# EAGLE design M503A (EAGLE 6.6.0)
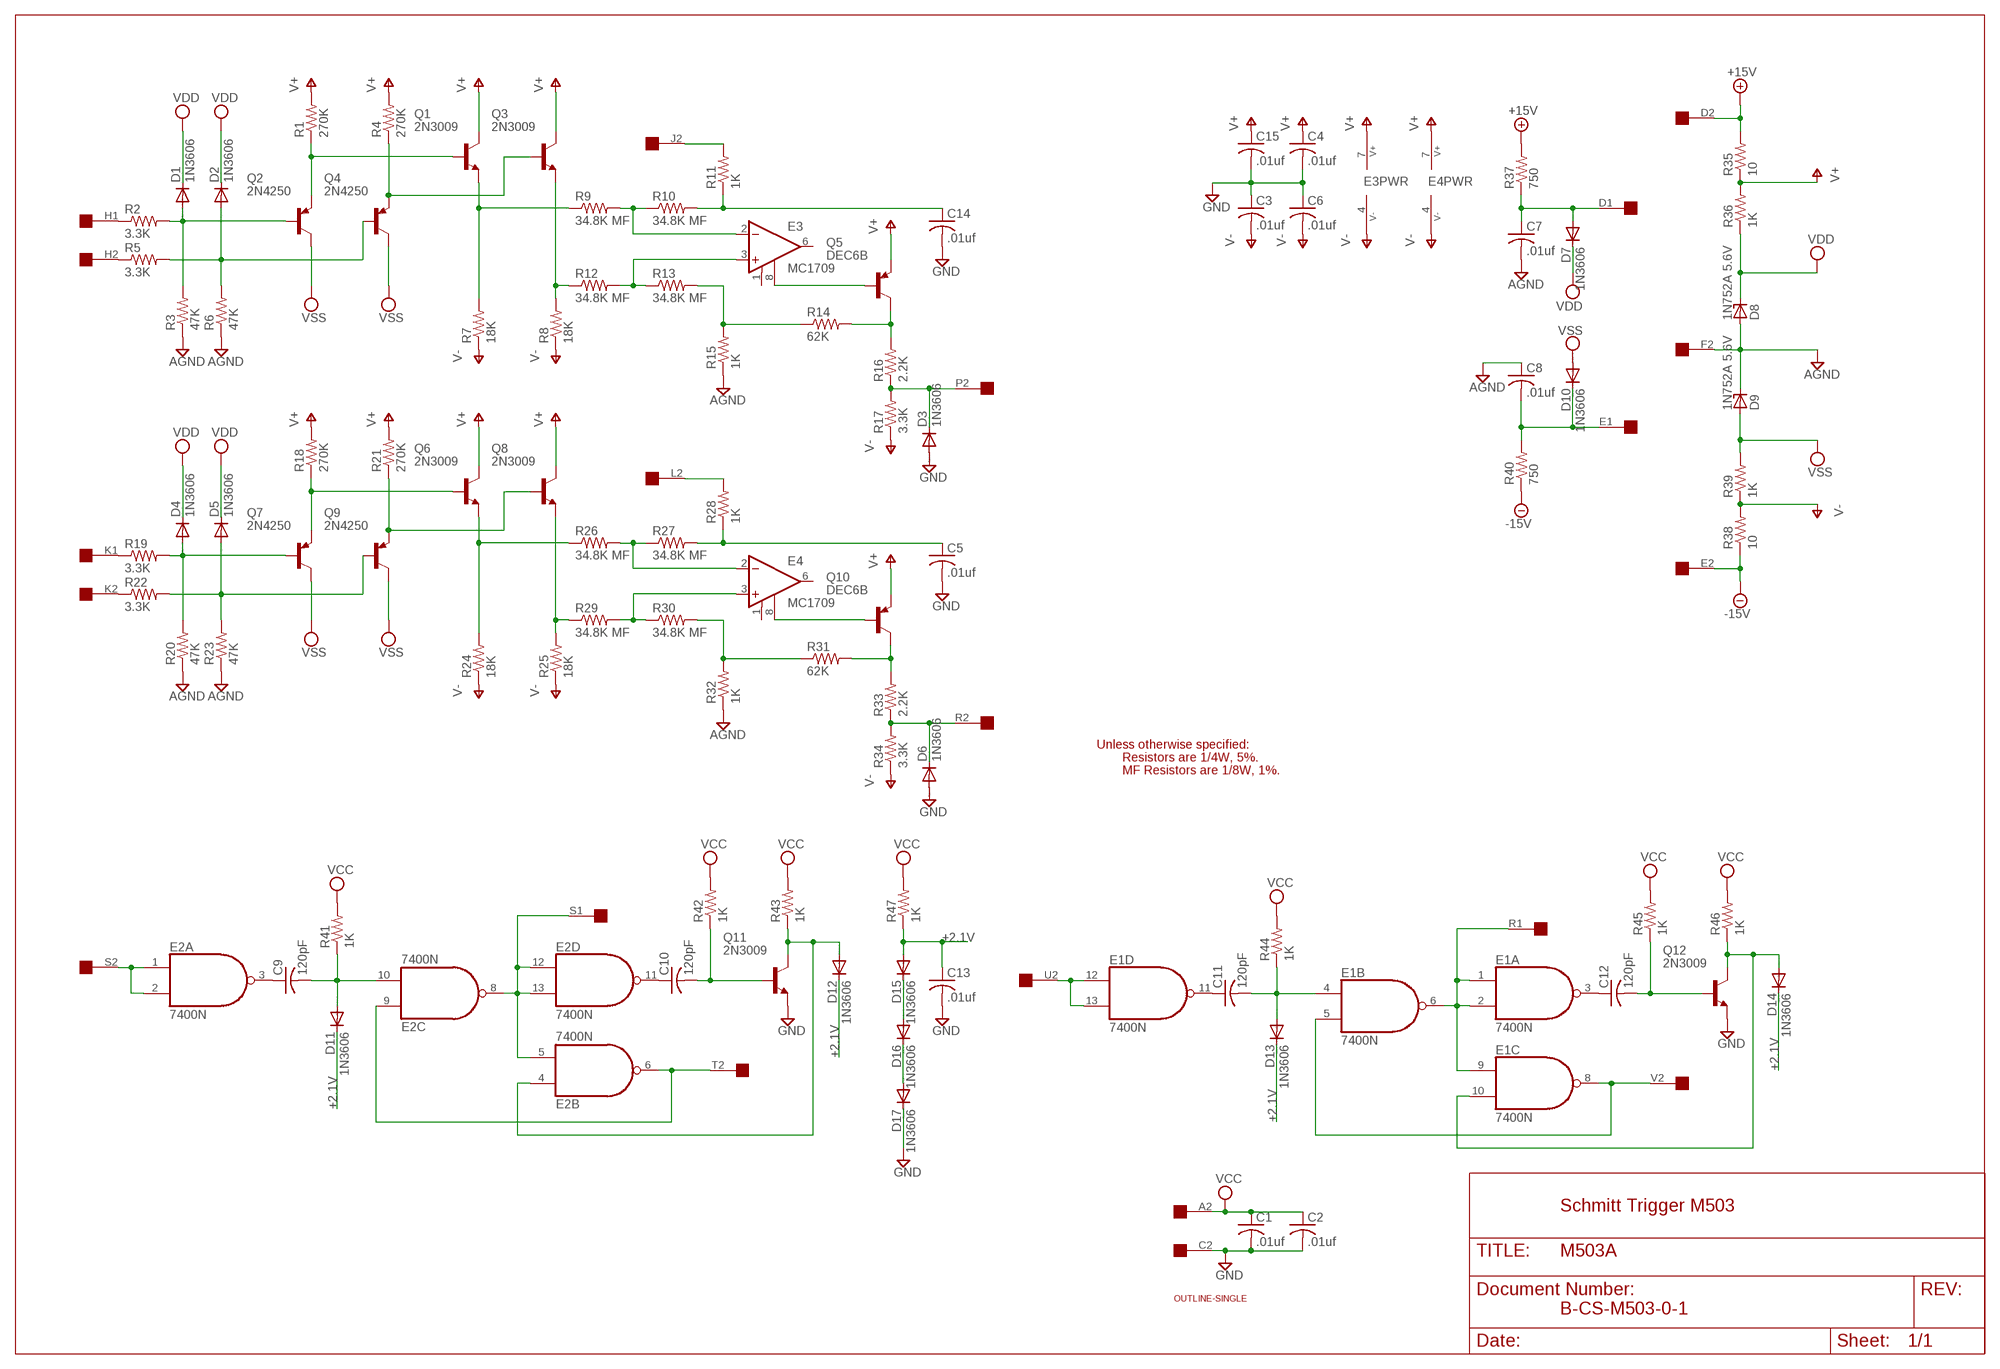
[diagram p0: schematic, sheet 1]

## Parts
C1  .01uf  C-US075-032X103  [C075-032X103]
C2  .01uf  C-US075-032X103  [C075-032X103]
C3  .01uf  C-US050-025X075  [C050-025X075]
C4  .01uf  C-US050-025X075  [C050-025X075]
C5  .01uf  C-US050-025X075  [C050-025X075]
C6  .01uf  C-US050-025X075  [C050-025X075]
C7  .01uf  C-US050-025X075  [C050-025X075]
C8  .01uf  C-US050-025X075  [C050-025X075]
C9  120pF  C-US050-025X075  [C050-025X075]
C10  120pF  C-US050-025X075  [C050-025X075]
C11  120pF  C-US050-025X075  [C050-025X075]
C12  120pF  C-US050-025X075  [C050-025X075]
C13  .01uf  C-US050-025X075  [C050-025X075]
C14  .01uf  C-US050-025X075  [C050-025X075]
C15  .01uf  C-US050-025X075  [C050-025X075]
D1  1N3606  1N4148DO35-10  [DO35-10]
D2  1N3606  1N4148DO35-10  [DO35-10]
D3  1N3606  1N4148DO35-10  [DO35-10]
D4  1N3606  1N4148DO35-10  [DO35-10]
D5  1N3606  1N4148DO35-10  [DO35-10]
D6  1N3606  1N4148DO35-10  [DO35-10]
D7  1N3606  1N4148DO35-10  [DO35-10]
D8  1N752A 5.6V  ZENER-DIODEDO35Z10  [DO35Z10]
D9  1N752A 5.6V  ZENER-DIODEDO35Z10  [DO35Z10]
D10  1N3606  1N4148DO35-10  [DO35-10]
D11  1N3606  1N4148DO35-10  [DO35-10]
D12  1N3606  1N4148DO35-10  [DO35-10]
D13  1N3606  1N4148DO35-10  [DO35-10]
D14  1N3606  1N4148DO35-10  [DO35-10]
D15  1N3606  1N4148DO35-10  [DO35-10]
D16  1N3606  1N4148DO35-10  [DO35-10]
D17  1N3606  1N4148DO35-10  [DO35-10]
E1  7400N  [DIL14]
E2  7400N  [DIL14]
E3  MC1709  LM301C  [TO99C]
E4  MC1709  LM301B  [TO99B]
Q1  2N3009  2N3019  [TO39]
Q2  2N4250  2N2904  [TO39]
Q3  2N3009  2N3019  [TO39]
Q4  2N4250  2N2904  [TO39]
Q5  DEC6B  2N2904  [TO39]
Q6  2N3009  2N3019  [TO39]
Q7  2N4250  2N2904  [TO39]
Q8  2N3009  2N3019  [TO39]
Q9  2N4250  2N2904  [TO39]
Q10  DEC6B  2N2904  [TO39]
Q11  2N3009  2N3019  [TO39]
Q12  2N3009  2N3019  [TO39]
R1  270K  R-US_0207/10  [0207/10]
R2  3.3K  R-US_0207/10  [0207/10]
R3  47K  R-US_0207/10  [0207/10]
R4  270K  R-US_0207/10  [0207/10]
R5  3.3K  R-US_0207/10  [0207/10]
R6  47K  R-US_0207/10  [0207/10]
R7  18K  R-US_0207/10  [0207/10]
R8  18K  R-US_0207/10  [0207/10]
R9  34.8K MF  R-US_0207/10  [0207/10]
R10  34.8K MF  R-US_0207/10  [0207/10]
R11  1K  R-US_0207/10  [0207/10]
R12  34.8K MF  R-US_0207/10  [0207/10]
R13  34.8K MF  R-US_0207/10  [0207/10]
R14  62K  R-US_0207/10  [0207/10]
R15  1K  R-US_0207/10  [0207/10]
R16  2.2K  R-US_0207/10  [0207/10]
R17  3.3K  R-US_0207/10  [0207/10]
R18  270K  R-US_0207/10  [0207/10]
R19  3.3K  R-US_0207/10  [0207/10]
R20  47K  R-US_0207/10  [0207/10]
R21  270K  R-US_0207/10  [0207/10]
R22  3.3K  R-US_0207/10  [0207/10]
R23  47K  R-US_0207/10  [0207/10]
R24  18K  R-US_0207/10  [0207/10]
R25  18K  R-US_0207/10  [0207/10]
R26  34.8K MF  R-US_0207/10  [0207/10]
R27  34.8K MF  R-US_0207/10  [0207/10]
R28  1K  R-US_0207/10  [0207/10]
R29  34.8K MF  R-US_0207/10  [0207/10]
R30  34.8K MF  R-US_0207/10  [0207/10]
R31  62K  R-US_0207/10  [0207/10]
R32  1K  R-US_0207/10  [0207/10]
R33  2.2K  R-US_0207/10  [0207/10]
R34  3.3K  R-US_0207/10  [0207/10]
R35  10  R-US_0207/10  [0207/10]
R36  1K  R-US_0207/10  [0207/10]
R37  750  R-US_0207/10  [0207/10]
R38  10  R-US_0207/10  [0207/10]
R39  1K  R-US_0207/10  [0207/10]
R40  750  R-US_0207/10  [0207/10]
R41  1K  R-US_0207/10  [0207/10]
R42  1K  R-US_0207/10  [0207/10]
R43  1K  R-US_0207/10  [0207/10]
R44  1K  R-US_0207/10  [0207/10]
R45  1K  R-US_0207/10  [0207/10]
R46  1K  R-US_0207/10  [0207/10]
R47  1K  R-US_0207/10  [0207/10]
U$2  SINGLE  [EDGE-CON2]
U$4  OUTLINE-SINGLE  [SINGLE]

## Nets
+2.1V: C13.1 D11.C D12.C D13.C D14.C D15.A R47.1
+15V [Supply]: R35.2 R37.2 U$2.D2
-15V [Supply]: R38.1 R40.1 U$2.E2
AGND [Supply]: C7.2 C8.1 D8.A D9.C R3.1 R6.1 R15.1 R20.1 R23.1 R32.1 U$2.F2
GND [Supply]: C1.2 C2.2 C3.1 C4.2 C5.2 C6.1 C13.2 C14.2 C15.2 D3.A D6.A D17.C Q11.1(E) Q12.1(E) U$2.C2
N$1: E1.1(A:I0) E1.2(A:I1) E1.6(B:O) E1.9(C:I0) U$2.R1
N$2: E1.5(B:I1) E1.8(C:O) U$2.V2
N$3: E1.12(D:I0) E1.13(D:I1) U$2.U2
N$4: C11.1 E1.11(D:O)
N$5: C11.2 D13.A E1.4(B:I0) R44.1
N$6: D14.A E1.10(C:I1) Q12.3(C) R46.1
N$7: Q6.2(B) Q7.1(E) R18.1
N$8: C12.2 Q12.2(B) R45.1
N$9: C12.1 E1.3(A:O)
N$10: E2.5(B:I1) E2.8(C:O) E2.12(D:I0) E2.13(D:I1) U$2.S1
N$11: E2.6(B:O) E2.9(C:I0) U$2.T2
N$12: C9.1 E2.3(A:O)
N$14: C9.2 D11.A E2.10(C:I1) R41.1
N$15: E2.1(A:I0) E2.2(A:I1) U$2.S2
N$16: Q1.2(B) Q2.1(E) R1.1
N$17: C10.2 Q11.2(B) R42.1
N$18: C10.1 E2.11(D:O)
N$19: D12.A E2.4(B:I0) Q11.3(C) R43.1
N$20: D1.A Q2.2(B) R2.2 R3.2
N$21: R2.1 U$2.H1
N$22: Q1.1(E) R7.2 R9.1
N$23: R5.1 U$2.H2
N$24: D2.A Q4.2(B) R5.2 R6.2
N$25: Q3.2(B) Q4.1(E) R4.1
N$26: Q3.1(E) R8.2 R12.1
N$27: E3.3(+IN) R12.2 R13.1
N$28: E3.2(-IN) R9.2 R10.1
N$29: C14.1 R10.2 R11.1
N$30: R13.2 R14.1 R15.2
N$31: E3.8(CMP) Q5.2(B)
N$32: Q5.3(C) R14.2 R16.2
N$33: R11.2 U$2.J2
N$34: D3.C R16.1 R17.2 U$2.P2
N$35: D4.A Q7.2(B) R19.2 R20.2
N$36: R22.1 U$2.K2
N$37: Q6.1(E) R24.2 R26.1
N$38: R19.1 U$2.K1
N$39: D5.A Q9.2(B) R22.2 R23.2
N$40: Q8.2(B) Q9.1(E) R21.1
N$41: Q8.1(E) R25.2 R29.1
N$42: E4.3(+IN) R29.2 R30.1
N$43: E4.2(-IN) R26.2 R27.1
N$44: C5.1 R27.2 R28.1
N$45: R30.2 R31.1 R32.2
N$46: E4.8(CMP) Q10.2(B)
N$47: Q10.3(C) R31.2 R33.2
N$48: R28.2 U$2.L2
N$49: D6.C R33.1 R34.2 U$2.R2
N$50: C7.1 D7.A R37.1 U$2.D1
N$51: C8.2 D10.C R40.2 U$2.E1
N$53: D15.C D16.A
N$54: D16.C D17.A
V+ [Supply]: C4.1 C15.1 E3.7(+10V) E4.7(+10V) Q1.3(C) Q3.3(C) Q5.1(E) Q6.3(C) Q8.3(C) Q10.1(E) R1.2 R4.2 R18.2 R21.2 R35.1 R36.2
V- [Supply]: C3.2 C6.2 E3.4(-15V) E4.4(-15V) R7.1 R8.1 R17.1 R24.1 R25.1 R34.1 R38.2 R39.1
VCC [Supply]: C1.1 C2.1 R41.2 R42.2 R43.2 R44.2 R45.2 R46.2 R47.2 U$2.A2
VDD [Supply]: D1.C D2.C D4.C D5.C D7.C D8.C R36.1
VSS [Supply]: D9.A D10.A Q2.3(C) Q4.3(C) Q7.3(C) Q9.3(C) R39.2
Unconnected: E3.1(ON/CMP) E3.6(OUT) E4.1(ON/CMP) E4.6(OUT) U$2.A1 U$2.B1 U$2.B2 U$2.C1 U$2.F1 U$2.J1 U$2.L1 U$2.M1 U$2.M2 U$2.N1 U$2.N2 U$2.P1 U$2.T1 U$2.U1 U$2.V1

## Notes on the sheet
- Unless otherwise specified:
- Resistors are 1/4W, 5%.
- MF Resistors are 1/8W, 1%.
- Schmitt Trigger M503
- B-CS-M503-0-1

## Power pins joined to a net without a drawn wire
GND: E1.7(P:GND) E2.7(P:GND)
VCC: E1.14(P:VCC) E2.14(P:VCC)

## Library data of the parts
C1-C15 = rcl:C-US: CAPACITOR, American symbol
D1-D7 D10-D17 = diode:1N4148: DIODE high speed (Philips)
D8 D9 = diode:ZENER-DIODE: Z-Diode
E1 E2 = 74xx-us:74*00: Quad 2-input NAND gate
E3 E4 = dec-con:LM301: LM301 Operational Amplifier
Q1 Q3 Q6 Q8 Q11 Q12 = transistor-npn:2N3019: NPN Transistor
Q2 Q4 Q5 Q7 Q9 Q10 = transistor-pnp:2N2904*: PNP Transistror
R1-R47 = rcl:R-US_: RESISTOR, American symbol
U$2 = dec-con:SINGLE: Single-Height DEC board
U$4 = dec-con:OUTLINE-*: Board outlines for DEC boards.

## Net classes
1 Supply: width 0.813 mm

## Board
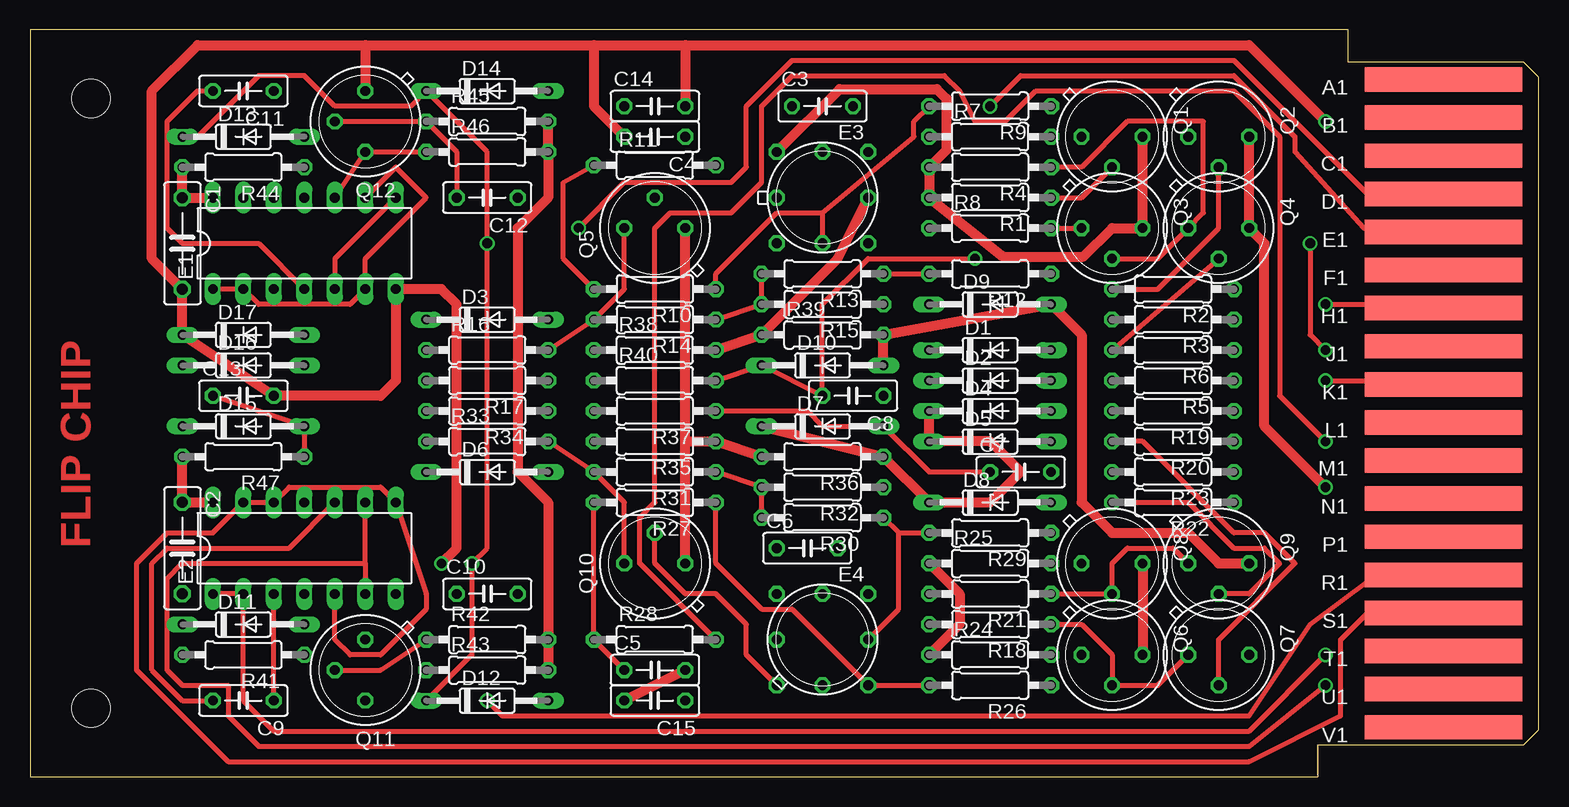
[diagram p1: board, top side]
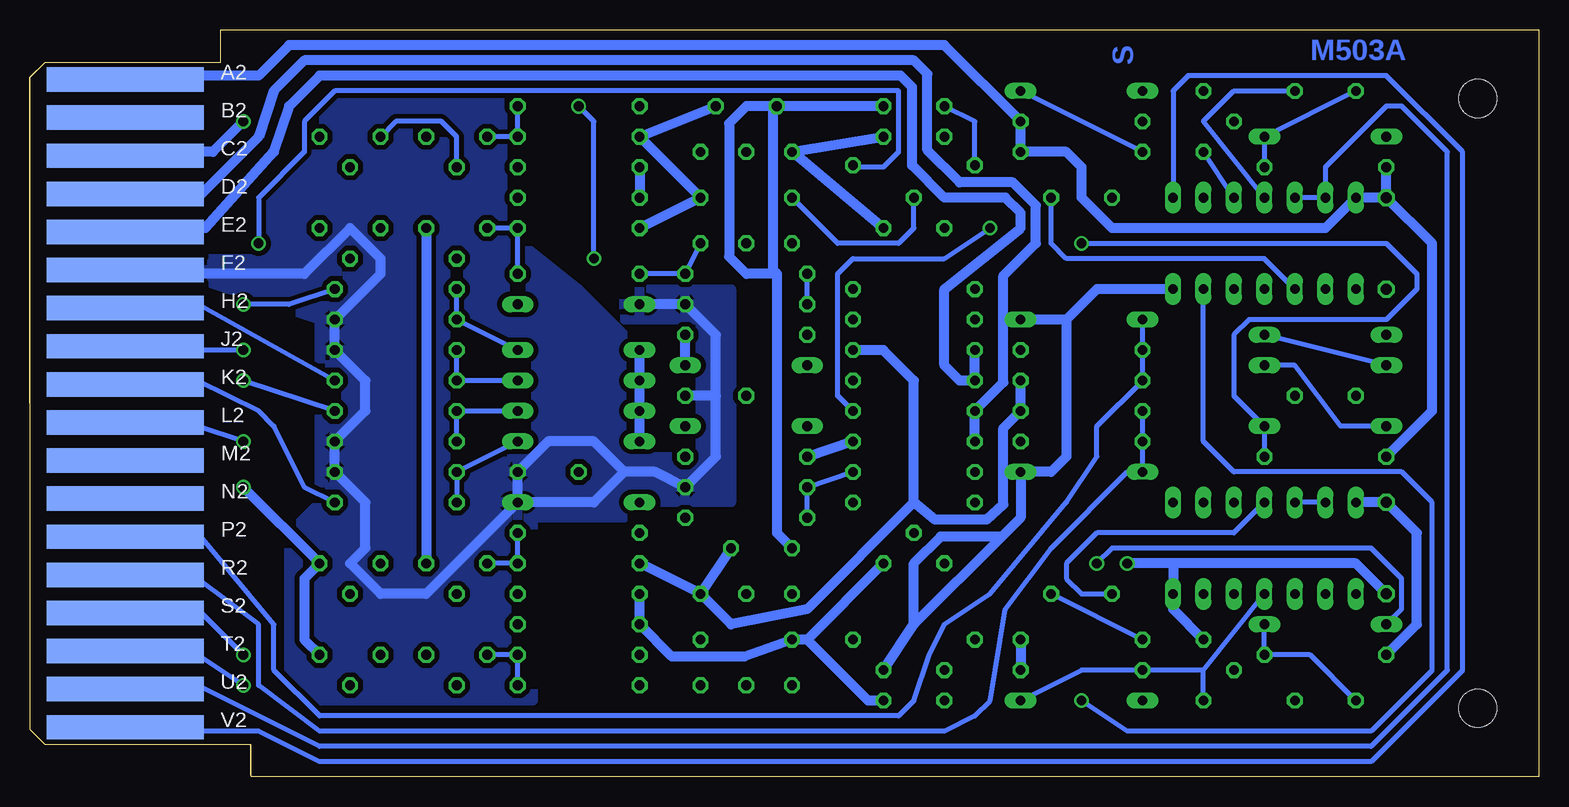
[diagram p2: board, bottom side, seen from below]

Size 125.73 x 62.23 mm. Coordinates in mm from the lower left corner, seen from the top.
Copper layers (1+16): Top 0.035mm / dielectric 1.5mm / Bottom 0.035mm
Design rules "16mils": minimum track width 16mil, minimum drill 32mil, track to track 15mil, track to pad 10mil, pad to pad 10mil, via to via 10mil, smd to smd 10mil, copper to edge 13mil, drill to drill 10mil, minimum pad ring 10mil, minimum via ring 8mil, stop-mask expansion 0mil, vias tented up to drill 0mil, thermal gap 10mil

### Footprints (pad centres in the part's own frame; a part is rotated, then mirrored left to right if it is on the bottom)
C075-032X103 = drill 0.914 octagon: 1 -3.81,0; 2 3.81,0
C050-025X075 = drill 0.813 octagon: 1 -2.54,0; 2 2.54,0
DO35-10 = drill 0.813 long: A 5.08,0; C -5.08,0
DO35Z10 = drill 0.813 long: A 5.08,0; C -5.08,0
DIL14 = drill 0.813 long: 1 -7.62,-3.81; 2 -5.08,-3.81; 3 -2.54,-3.81; 4 0,-3.81; 5 2.54,-3.81; 6 5.08,-3.81; 7 7.62,-3.81; 8 7.62,3.81; 9 5.08,3.81; 10 2.54,3.81; 11 0,3.81; 12 -2.54,3.81; 13 -5.08,3.81; 14 -7.62,3.81
TO99C = drill 0.813 octagon: 1 -3.81,-3.81; 2 0,-3.81; 3 3.81,-3.81; 4 3.81,0; 5 3.81,3.81; 6 0,3.81; 7 -3.81,3.81; 8 -3.81,0
TO99B = drill 0.813 octagon: 1 0,-3.81; 2 3.81,-3.81; 3 3.81,0; 4 3.81,3.81; 5 0,3.81; 6 -3.81,3.81; 7 -3.81,0; 8 -3.81,-3.81
TO39 = drill 0.813 octagon: 1 0,-2.54; 2 2.54,0; 3 0,2.54
0207/10 = drill 0.813 octagon: 1 -5.08,0; 2 5.08,0
EDGE-CON2 = smd 13.106 x 2.032: A1 7.938,4.128; B1 7.938,7.303; C1 7.938,10.477; D1 7.938,13.652; E1 7.938,16.828; F1 7.938,20.003; H1 7.938,23.177; J1 7.938,26.352; K1 7.938,29.527; L1 7.938,32.703; M1 7.938,35.877; N1 7.938,39.053; P1 7.938,42.227; R1 7.938,45.403; S1 7.938,48.578; T1 7.938,51.752; U1 7.938,54.928; V1 7.938,58.102 | smd 13.106 x 2.032 bottom: A2 7.938,4.128; B2 7.938,7.303; C2 7.938,10.477; D2 7.938,13.652; E2 7.938,16.828; F2 7.938,20.003; H2 7.938,23.177; J2 7.938,26.352; K2 7.938,29.527; L2 7.938,32.703; M2 7.938,35.877; N2 7.938,39.053; P2 7.938,42.227; R2 7.938,45.403; S2 7.938,48.578; T2 7.938,51.752; U2 7.938,54.928; V2 7.938,58.102
SINGLE = hole 3.175: 120.65,56.515; 120.65,5.715

### Placement (x,y rotation side)
C1  12.7,44.45 270 top
C2  12.7,19.05 270 top
C3  66.04,55.88 0 top
C4  52.07,53.34 180 top
C5  52.07,8.89 0 top
C6  64.77,19.05 0 top
C7  82.55,25.4 0 top
C8  68.58,31.75 180 top
C9  17.78,6.35 180 top
C10  38.1,15.24 0 top
C11  17.78,57.15 180 top
C12  38.1,48.26 180 top
C13  17.78,31.75 0 top
C14  52.07,55.88 0 top
C15  52.07,6.35 180 top
D1  80.01,35.56 0 top
D2  80.01,33.02 0 top
D3  38.1,38.1 0 top
D4  80.01,30.48 0 top
D5  80.01,27.94 0 top
D6  38.1,25.4 0 top
D7  66.04,29.21 0 top
D8  80.01,22.86 0 top
D9  80.01,39.37 0 top
D10  66.04,34.29 0 top
D11  17.78,12.7 0 top
D12  38.1,6.35 0 top
D13  17.78,53.34 0 top
D14  38.1,57.15 0 top
D15  17.78,29.21 0 top
D16  17.78,34.29 0 top
D17  17.78,36.83 0 top
E1  22.86,44.45 0 top
E2  22.86,19.05 0 top
E3  66.04,48.26 0 top
E4  66.04,11.43 0 top
Q1  90.17,53.34 270 top
Q2  99.06,53.34 270 top
Q3  90.17,45.72 270 top
Q4  99.06,45.72 270 top
Q5  52.07,45.72 90 top
Q6  90.17,10.16 270 top
Q7  99.06,10.16 270 top
Q8  90.17,17.78 270 top
Q9  99.06,17.78 270 top
Q10  52.07,17.78 90 top
Q11  27.94,8.89 180 top
Q12  27.94,54.61 180 top
R1  80.01,48.26 180 top
R2  95.25,40.64 180 top
R3  95.25,38.1 180 top
R4  80.01,50.8 180 top
R5  95.25,33.02 180 top
R6  95.25,35.56 180 top
R7  80.01,53.34 0 top
R8  80.01,45.72 0 top
R9  80.01,55.88 180 top
R10  52.07,40.64 180 top
R11  52.07,50.96 0 top
R12  80.01,41.91 180 top
R13  66.04,41.91 180 top
R14  52.07,38.1 180 top
R15  66.04,39.37 180 top
R16  38.1,35.56 0 top
R17  38.1,33.02 180 top
R18  80.01,12.7 180 top
R19  95.25,30.48 180 top
R20  95.25,27.94 180 top
R21  80.01,15.24 180 top
R22  95.25,22.86 180 top
R23  95.25,25.4 180 top
R24  80.01,10.16 0 top
R25  80.01,17.78 0 top
R26  80.01,7.62 180 top
R27  52.07,22.86 180 top
R28  52.07,11.43 0 top
R29  80.01,20.32 180 top
R30  66.04,21.59 180 top
R31  52.07,25.4 180 top
R32  66.04,24.13 180 top
R33  38.1,27.94 0 top
R34  38.1,30.48 180 top
R35  52.07,27.94 180 top
R36  66.04,26.67 180 top
R37  52.07,30.48 180 top
R38  52.07,35.56 0 top
R39  66.04,36.83 0 top
R40  52.07,33.02 0 top
R41  17.78,10.16 180 top
R42  38.1,11.43 0 top
R43  38.1,8.89 0 top
R44  17.78,50.8 180 top
R45  38.1,54.61 0 top
R46  38.1,52.07 0 top
R47  17.78,26.67 180 top
U$1  [FLIPCHIP]  0,0 0 top
U$2  125.73,62.23 180 top
U$4  125.73,62.23 180 top

### Tracks (layer width: path | path; a pad name or v marks a point on that pad's centre or on a via)
+2.1V  (via drill 0.81)
  Top 0.406: C13.1 D15.A R47.1 | D13.C 13.97,53.34 19.05,58.42 22.86,58.42 25.4,55.88 31.75,55.88 D14.C 38.1,52.07 v38.1,44.45 38.1,19.05 v36.83,17.78 36.83,10.16 D12.C
  Bottom 0.406: D11.C 11.43,13.97 11.43,16.51 13.97,19.05 35.56,19.05 v36.83,17.78 | R47.1 D15.A 25.4,31.75 25.4,36.83 24.13,38.1 12.7,38.1 10.16,40.64 10.16,41.91 12.7,44.45 v38.1,44.45
+15V
  Bottom 0.813: U$2.D2 117.14,48.56 116.84,48.26 111.76,48.26 106.68,53.34 105.41,57.15 102.87,59.69 52.07,59.69 50.96,58.58 50.96,52.23 48.26,49.53 43.81,49.53 41.91,47.62 41.91,44.45 44.61,41.75 44.61,32.86 R37.2 R35.2
-15V
  Bottom 0.813: U$2.E2 116.84,45.72 111.12,45.72 105.41,52.07 104.14,55.88 101.6,58.42 53.18,58.42 52.23,57.47 52.23,50.96 49.53,48.26 44.45,48.26 43.18,46.99 43.18,45.72 49.53,40.64 49.53,34.29 48.26,33.02 R40.1 R38.1
AGND
  Bottom 0.813: D9.C R15.1 68.58,36.83 68.58,31.75 | 68.58,31.75 C8.1 | D8.A C7.2 82.55,27.94 78.74,27.94 76.2,25.4 | 76.2,25.4 73.66,25.4 R32.1 68.58,26.67 68.58,31.75 | 76.2,25.4 78.74,22.86 D8.A | D8.A 92.71,15.24 96.52,15.24 99.06,17.78 97.79,19.05 97.79,22.86 R23.1 R20.1 97.79,30.48 97.79,33.02 R6.1 R3.1 96.52,41.91 96.52,43.18 99.06,45.72 102.87,41.91 116.84,41.91 U$2.F2
  pour Bottom (isolate 0.406): 114.3,41.91 111.76,43.18 106.68,43.18 106.68,57.15 86.36,57.15 86.36,45.72 80.01,40.64 76.2,36.83 76.2,26.67 69.85,26.67 69.85,38.1 76.2,38.1 76.2,40.64 67.31,40.64 67.31,22.86 76.2,22.86 76.2,21.59 83.82,21.59 83.82,6.35 101.6,6.35 104.14,8.89 104.14,20.32 101.6,22.86 101.6,38.1 113.03,41.91
GND  (via drill 0.81)
  Top 0.813: v107.95,54.61 101.6,60.96 54.61,60.96 | 54.61,60.96 C14.2 | 46.99,60.96 54.61,60.96 | 46.99,60.96 46.99,55.88 C4.2 | 27.94,60.96 46.99,60.96 | 27.94,60.96 13.97,60.96 10.16,57.15 10.16,43.18 C1.2 D17.C C13.2 29.21,31.75 30.48,33.02 E1.7 34.29,40.64 35.56,39.37 35.56,19.05 v34.29,17.78 | 27.94,60.96 Q12.1 | C5.2 C15.2
  Bottom 0.813: U$2.C2 117.17,51.74 116.84,52.07 110.49,52.07 v107.95,54.61 | 30.48,17.78 v34.29,17.78 | 30.48,17.78 E2.7 30.48,13.97 Q11.1 | C2.2 15.24,17.78 30.48,17.78 | 39.37,38.1 D3.A | 39.37,38.1 36.83,40.64 E1.7 | 39.37,38.1 39.37,26.67 40.64,25.4 D6.A 43.18,21.59 44.77,20 | C14.2 C3.1 | 52.07,12.7 C5.2 | 52.07,12.7 52.07,17.78 49.85,20 44.77,20 | 44.77,20 52.07,12.7 | C3.1 63.82,55.56 63.82,42.23 63.5,41.91 | 63.5,41.91 63.5,20.32 C6.1 | C3.1 66.04,55.88 67.47,54.45 67.47,43.34 66.04,41.91 63.5,41.91
N$1  (via drill 0.81)
  Top 0.406: U$2.R1 116.84,16.51 111.76,16.51 106.68,12.7 101.6,5.08 39.37,5.08 v38.1,6.35 | E1.1 E1.2 19.05,39.37 26.67,39.37 E1.6 27.94,43.18 33.02,48.26 30.48,50.8 E1.9
  Bottom 0.406: v38.1,6.35 34.29,3.81 13.97,3.81 8.89,8.89 8.89,22.86 11.43,25.4 25.4,25.4 27.94,27.94 E1.6
N$2
  Top 0.406: E1.8 25.4,43.18 E1.5
  Bottom 0.406: U$2.V2 116.84,3.81 106.68,3.81 101.6,1.27 13.97,1.27 6.35,8.89 6.35,52.07 12.7,58.42 29.21,58.42 30.48,57.15 E1.8
N$3
  Bottom 0.406: U$2.U2 116.84,7.62 111.76,7.62 101.6,2.54 13.97,2.54 7.62,8.89 7.62,52.07 11.43,55.88 12.7,55.88 17.78,50.8 E1.13 E1.12
N$4
  Bottom 0.406: C11.1 25.4,57.15 27.94,54.61 E1.11
N$5
  Top 0.406: C11.2 13.97,57.15 11.43,54.61 11.43,45.72 12.7,44.45 19.05,44.45 E1.4
  Bottom 0.406: R44.1 D13.A C11.2
N$6
  Top 0.406: E1.10 Q12.3 R46.1
  Bottom 0.406: E1.10 Q12.3 | R46.1 D14.A
N$7
  Top 0.406: R18.1 87.63,12.7 90.17,10.16 Q6.2 93.98,7.62 Q7.1
N$8
  Top 0.406: Q12.2 R45.1 35.56,52.07 C12.2
N$9
  Bottom 0.406: E1.3 22.86,43.18 39.37,43.18 40.64,44.45 C12.1
N$10
  Top 0.406: U$2.S1 116.84,13.97 111.76,13.97 109.22,11.43 109.22,5.08 101.6,1.27 16.51,1.27 8.89,8.89 8.89,17.78 11.43,20.32 15.24,20.32 E2.13 E2.12 21.59,24.13 29.21,24.13 E2.8 33.02,15.24 33.02,13.97 29.21,10.16 26.67,10.16 25.4,11.43 E2.5
  Bottom 0.406: E2.13 E2.12
N$11  (via drill 0.81)
  Top 0.406: v107.95,7.62 101.6,2.54 19.05,2.54 16.51,5.08 16.51,7.62 12.7,7.62 11.43,8.89 11.43,16.51 12.7,17.78 27.94,17.78 | 27.94,17.78 E2.6 | 27.94,17.78 E2.9
  Bottom 0.406: U$2.T2 116.84,10.16 111.76,10.16 v107.95,7.62
N$12
  Top 0.406: C9.1 E2.3
N$14
  Top 0.406: C9.2 12.7,6.35 10.16,8.89 10.16,17.78 11.43,19.05 21.59,19.05 E2.10
  Bottom 0.406: D11.A R41.1 19.05,10.16 C9.2
N$15  (via drill 0.81)
  Top 0.406: v107.95,10.16 101.6,3.81 20.32,3.81 17.78,6.35 E2.2 E2.1
  Bottom 0.406: U$2.S2 116.84,13.97 111.76,13.97 v107.95,10.16
N$16
  Top 0.406: R1.1 87.63,48.26 Q1.2
  Bottom 0.406: Q1.2 90.17,53.34 91.44,54.61 95.25,54.61 Q2.1
N$17
  Top 0.406: Q11.2 29.21,8.89 R42.1
  Bottom 0.406: R42.1 C10.2
N$18
  Bottom 0.406: E2.11 25.4,20.32 36.83,20.32 39.37,17.78 39.37,16.51 38.1,15.24 C10.1
N$19
  Bottom 0.406: 27.94,8.89 E2.4 | Q11.3 27.94,8.89 | 27.94,8.89 R43.1 38.1,8.89 D12.A
N$20
  Top 0.406: R2.2 93.98,40.64 99.06,45.72 Q2.2
  Bottom 0.406: D1.A R3.2 R2.2
N$21  (via drill 0.81 pad 0.25)
  Top 0.406: U$2.H1 116.84,39.37 v107.95,39.37
  Bottom 0.406: v107.95,39.37 104.14,39.37 R2.1
N$22
  Bottom 0.406: Q1.1 R7.2 R9.1
N$23
  Bottom 0.406: R5.1 111.76,39.37 116.84,39.37 U$2.H2
N$24
  Top 0.406: R6.2 Q4.2
  Bottom 0.406: D2.A R5.2 R6.2
N$25
  Top 0.406: Q3.2 93.98,43.18 Q4.1 97.79,46.99 97.79,54.61 91.44,54.61 87.63,50.8 R4.1
N$26
  Top 0.406: R8.2 Q3.1
  Bottom 0.406: Q3.1 R8.2 R12.1
N$27
  Top 0.406: R13.1 R12.2
  Bottom 0.406: E3.3 R13.1 R12.2
N$28
  Top 0.406: R10.1 57.15,41.91 62.23,46.99 66.04,46.99 | 66.04,46.99 E3.2 | R9.2 73.66,54.61 73.66,53.34 66.04,46.99
N$29
  Top 0.406: R10.2 44.45,43.18 44.45,49.53 R11.1
  Bottom 0.406: C14.1 46.99,54.61 R11.1
N$30
  Top 0.406: R14.1 R15.2 R13.2
  Bottom 0.406: R15.2 R13.2
N$31
  Bottom 0.406: E3.8 58.42,44.45 53.34,44.45 52.07,45.72 Q5.2
N$32
  Top 0.406: R16.2 R14.2 49.53,40.64 Q5.3
N$33  (via drill 0.81)
  Top 0.406: v106.68,44.45 106.68,36.83 v107.95,35.56
  Bottom 0.406: R11.2 57.15,50.8 54.61,50.8 53.34,52.07 53.34,57.15 100.33,57.15 102.87,54.61 102.87,52.07 106.68,48.26 v106.68,44.45 | U$2.J2 116.84,35.56 v107.95,35.56
N$34
  Bottom 0.406: U$2.P2 116.84,20.32 111.76,20.32 105.41,12.7 105.41,8.89 101.6,5.08 53.34,5.08 52.07,6.35 50.8,10.16 49.53,12.7 45.72,15.24 39.37,22.86 36.83,26.67 36.83,29.21 R17.2 R16.1 D3.C
N$35
  Top 0.406: Q7.2 99.06,11.43 105.41,17.78 102.87,20.32 100.33,20.32 92.71,27.94 R20.2
  Bottom 0.406: D4.A R19.2 R20.2
N$36
  Bottom 0.406: U$2.K2 116.84,33.02 111.76,33.02 106.68,30.48 105.41,29.21 102.87,24.13 R22.1
N$37
  Bottom 0.406: Q6.1 R24.2 R26.1
N$38  (via drill 0.81)
  Top 0.406: U$2.K1 116.84,33.02 v107.95,33.02
  Bottom 0.406: R19.1 v107.95,33.02
N$39
  Top 0.406: Q9.2 101.6,15.24 104.14,17.78 102.87,19.05 100.33,19.05 96.52,22.86 R22.2
  Bottom 0.406: D5.A R23.2 R22.2
N$40
  Top 0.406: R21.1 Q8.2 90.17,17.78 91.44,19.05 95.25,19.05 Q9.1
N$41
  Bottom 0.406: Q8.1 R25.2 R29.1
N$42
  Top 0.406: 72.39,20.32 R30.1 | 72.39,20.32 R29.2 | E4.3 72.39,13.97 72.39,20.32
N$43
  Top 0.406: R27.1 57.15,17.78 60.96,13.97 63.5,13.97 E4.2 R26.2
N$44
  Top 0.406: R27.2 R28.1 C5.1
N$45
  Top 0.406: R31.1 R32.2 R30.2
  Bottom 0.406: R31.1 R32.2 R30.2
N$46
  Top 0.406: E4.8 59.69,10.16 59.69,12.7 57.15,15.24 54.61,15.24 52.07,17.78 Q10.2
N$47
  Top 0.406: R33.2 R31.2 49.53,22.86 Q10.3
N$48  (via drill 0.81)
  Top 0.406: R28.2 50.8,17.78 50.8,21.59 52.07,22.86 52.07,45.72 53.34,46.99 58.42,46.99 60.96,49.53 60.96,55.88 63.5,58.42 76.2,58.42 77.47,57.15 78.74,54.61 81.28,54.61 83.82,57.15 100.33,57.15 104.14,53.34 104.14,31.75 v107.95,27.94
  Bottom 0.406: U$2.L2 116.84,29.21 111.76,29.21 v107.95,27.94
N$49
  Bottom 0.406: R34.2 R33.1 D6.C 34.29,25.4 40.64,19.05 44.45,13.97 45.72,6.35 46.99,5.08 49.53,3.81 101.6,3.81 106.68,7.62 106.68,12.7 111.76,16.51 116.84,16.51 U$2.R2
N$50  (via drill 0.81)
  Top 0.406: U$2.D1 116.84,48.26 111.76,48.26 100.33,59.69 63.5,59.69 59.69,55.88 59.69,50.8 58.42,49.53 49.53,49.53 v45.72,45.72 | R37.1 64.77,30.48 66.04,29.21 D7.A 74.93,25.4 C7.1
  Bottom 0.406: v45.72,45.72 49.53,43.18 57.15,43.18 58.42,41.91 58.42,31.75 R37.1
N$51  (via drill 0.81, 0.81 pad 0.25)
  Top 0.406: U$2.E1 116.84,45.72 111.12,45.72 105.41,52.07 105.41,53.34 100.33,58.42 82.55,58.42 v80.01,55.88 | R40.2 D10.C C8.2 66.04,39.37 69.85,43.18 v78.74,43.18
  Bottom 0.406: v80.01,55.88 78.74,54.61 v78.74,43.18
N$53
  Bottom 0.406: D15.C 16.51,29.21 20.32,34.29 D16.A
N$54
  Bottom 0.406: D16.C D17.A
V+
  Top 0.813: Q8.3 Q6.3 | Q1.3 Q3.3 90.17,45.72 87.79,43.34 81.12,43.34 R1.2 R4.2 76.36,52.23 76.36,56.52 75.56,57.31 67.47,57.31 E3.7 | Q10.1 54.61,27.94 | 54.61,27.94 Q5.1 | R36.2 R35.1 54.61,27.94
  Bottom 0.813: 60.96,11.43 Q10.1 | 60.96,11.43 E4.7 66.2,10 72.23,10 R18.2 R21.2 | C15.1 55.88,6.35 60.96,11.43 | C4.1 E3.7 Q5.1 | R4.2 R1.2 | Q3.3 Q8.3 | R35.1 R36.2
V-
  Top 0.813: R38.2 R39.1 67.31,43.18 E3.4 | R24.1 77.47,12.7 77.47,15.24 R25.1
  Bottom 0.813: E4.4 C6.2 | E4.4 R25.1 | R17.1 R34.1 44.61,29.05 44.61,22.7 46.04,21.43 50.32,21.43 52.07,22.86 | C3.2 R7.1 E3.4 R8.1 | E4.4 67.31,12.7 60.96,13.97 52.07,22.86 | R38.2 54.61,35.56 52.07,33.02 52.07,22.86
VCC
  Top 0.813: E2.14 C2.1 R47.2 | R44.2 C1.1 E1.14 | R43.2 R42.2 43.18,22.86 40.64,25.4 40.64,45.72 43.18,48.26 R46.2 R45.2
  Bottom 0.813: U$2.A2 117.24,58.02 116.84,58.42 106.68,58.42 104.14,60.96 49.53,60.96 R45.2 R46.2 39.37,52.07 38.1,50.8 38.1,48.26 35.56,45.72 17.78,45.72 E1.14 C1.1 | R42.2 R43.2 | E2.14 C2.1 10.16,20.32 10.16,12.7 R41.2 | C1.1 R44.2 | R47.2 8.89,30.48 8.89,44.45 C1.1
VDD
  Top 0.813: D4.C D5.C 80.01,27.94 82.55,25.4 80.01,22.86 D8.C R36.1 D7.C
  Bottom 0.813: D5.C D4.C D2.C D1.C
VSS  (via drill 0.81)
  Top 0.813: Q2.3 Q4.3 102.87,44.45 102.87,29.21 v107.95,24.13 | D10.A R39.2 D9.A 87.63,36.83 87.63,22.86 90.17,20.32 96.52,20.32 99.06,17.78 Q9.3
  Bottom 0.813: D10.A R39.2 | Q7.3 102.87,11.43 102.87,16.51 Q9.3 v107.95,24.13

### Text on the board
Bottom: S | M503A